# Altium schematic sheet Arduino_Pro_Micro_SCH.SchDoc
size A4; SheetNumber: 1; SheetTotal: 1
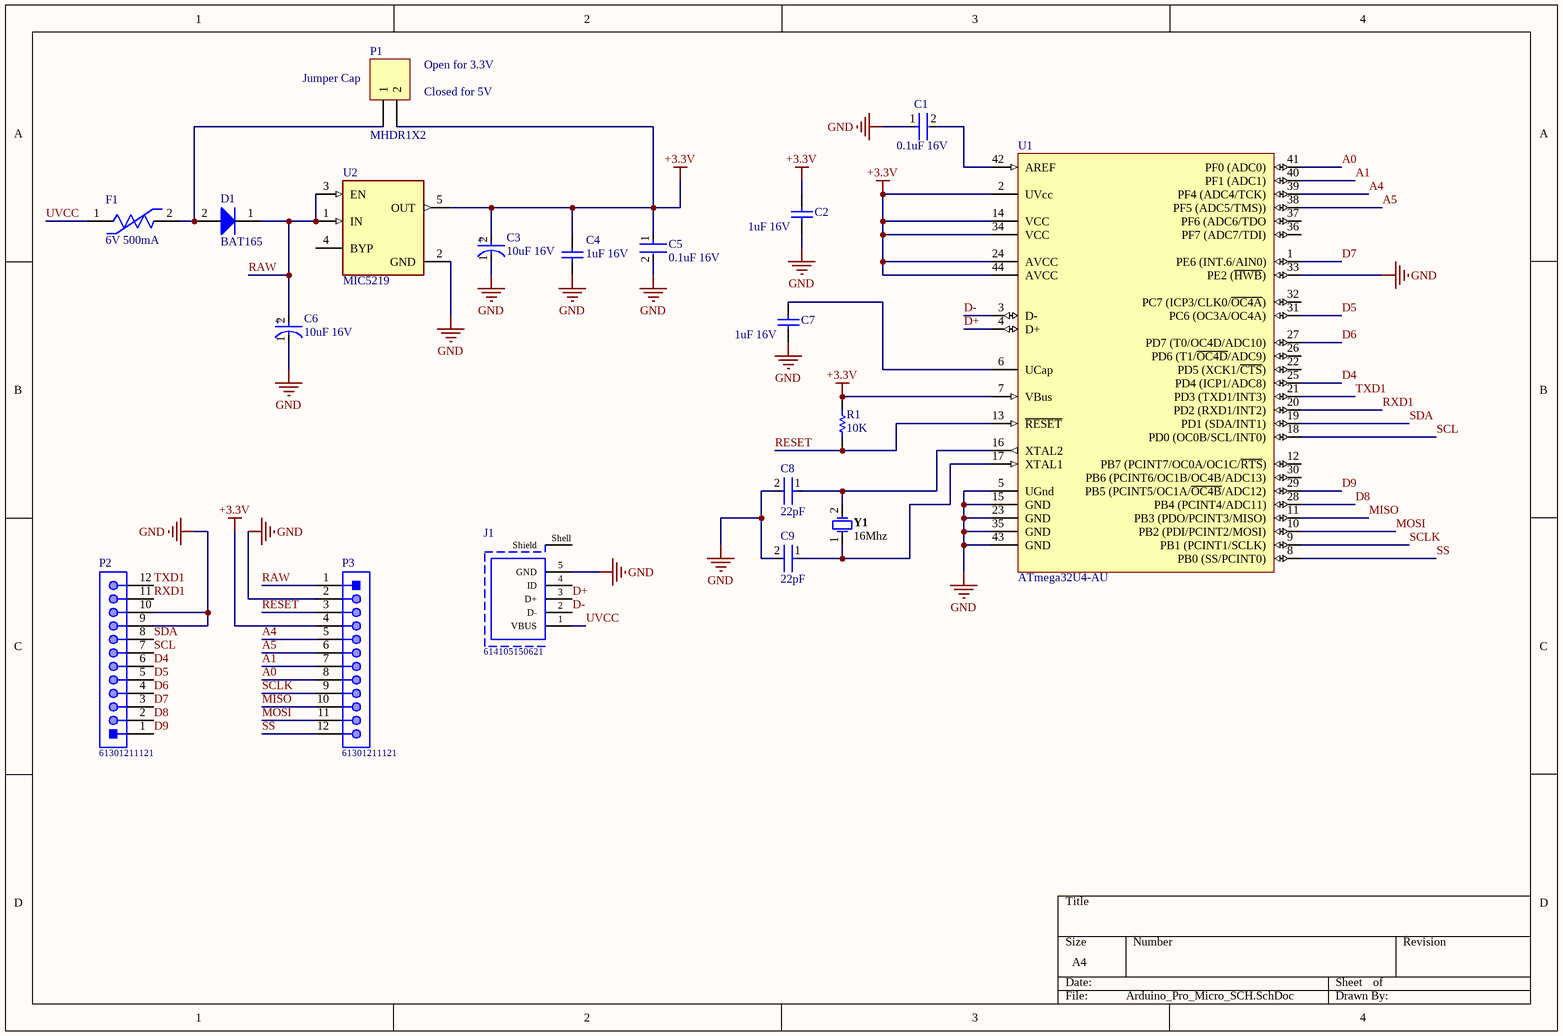
[diagram p0: Arduino_Pro_Micro_SCH.SchDoc]

## Parts
C1  0.1uF 16V  [FP-C0805C-DN-MFG]
C2  1uF 16V  [CAPC2013X145X50LL20T25]
C3  10uF 16V  [FP-T491C106K016AT-MFG]
C4  1uF 16V  [CAPC2013X145X50LL20T25]
C5  0.1uF 16V  [FP-C0805C-DN-MFG]
C6  10uF 16V  [FP-T491C106K016AT-MFG]
C7  1uF 16V  [CAPC2013X145X50LL20T25]
C8  22pF  [FP-C0805C-DN-MFG]
C9  22pF  [FP-C0805C-DN-MFG]
D1  BAT165  [INF-SOD323_V]
F1  6V 500mA  [FP-1206L050YR-MFG]
J1  614105150621  [614105150621]
P1  MHDR1X2  [MHDR1X2]
P2  61301211121  [61301211121]
P3  61301211121  [61301211121]
R1  10K  [RESC2013X60X35NL10T20]
U1  ATmega32U4-AU  [44ML_L]
U2  MIC5219  [FP-SOT23-5LD-PL-1-IPC_C]
Y1  16Mhz  [FOX-HC49SDLF_V]

## Nets
+3.3V: C2.2 C3.2(A) C4.2 C5.1 P1.2 P3.4 R1.2 U1.2(UVcc) U1.7(VBus) U1.14(VCC) U1.24(AVCC) U1.34(VCC) U1.44(AVCC) U2.5(OUT)
GND: C1.1 C2.1 C3.1(C) C4.1 C5.2 C6.1(C) C7.1 C8.2 C9.2 J1.5(GND) P2.9 P2.10 P3.2 U1.5(UGnd) U1.15(GND) U1.23(GND) U1.33(PE2_(~{HWB})) U1.35(GND) U1.43(GND) U2.2(GND)
A0: P3.8 U1.41(PF0_(ADC0))
A1: P3.7 U1.40(PF1_(ADC1))
A4: P3.5 U1.39(PF4_(ADC4/TCK))
A5: P3.6 U1.38(PF5_(ADC5/TMS)))
D4: P2.6 U1.25(PD4_(ICP1/ADC8))
D5: P2.5 U1.31(PC6_(OC3A/OC4A))
D6: P2.4 U1.27(PD7_(T0/OC4D/ADC10))
D7: P2.3 U1.1(PE6_(INT.6/AIN0))
D8: P2.2 U1.28(PB4_(PCINT4/ADC11))
D9: P2.1 U1.29(PB5_(PCINT5/OC1A/~{OC4B}/ADC12))
D+: J1.3(D+) U1.4(D+)
D-: J1.2(D-) U1.3(D-)
MISO: P3.10 U1.11(PB3_(PDO/PCINT3/MISO))
MOSI: P3.11 U1.10(PB2_(PDI/PCINT2/MOSI))
RAW: C6.2(A) D1.1(K) P3.1 U2.1(IN) U2.3(EN)
RESET: P3.3 R1.1 U1.13(~{RESET})
RXD1: P2.11 U1.20(PD2_(RXD1/INT2))
SCL: P2.7 U1.18(PD0_(OC0B/SCL/INT0))
SCLK: P3.9 U1.9(PB1_(PCINT1/SCLK))
SDA: P2.8 U1.19(PD1_(SDA/INT1))
SS: P3.12 U1.8(PB0_(SS/PCINT0))
TXD1: P2.12 U1.21(PD3_(TXD1/INT3))
UVCC: F1.1 J1.1(VBUS)
NetC1_2: C1.2 U1.42(AREF)
NetC7_2: C7.2 U1.6(UCap)
NetC8_1: C8.1 U1.16(XTAL2) Y1.2
NetC9_1: C9.1 U1.17(XTAL1) Y1.1
NetD1_2: D1.2(A) F1.2 P1.1

Not connected (* = marked no-connect by the designer): J1 4(ID) Shell(Shield); U1 12(PB7_(PCINT7/OC0A/OC1C/~{RTS})) 22(PD5_(XCK1/~{CTS})) 26(PD6_(T1/~{OC4D}/ADC9)) 30(PB6_(PCINT6/OC1B/OC4B/ADC13)) 32(PC7_(ICP3/CLK0/~{OC4A})) 36(PF7_(ADC7/TDI)) 37(PF6_(ADC6/TDO); U2 4(BYP)

## Notes on the sheet
- (near P1) Jumper Cap
- (near P1) Open for 3.3V
- (near P1) Closed for 5V
- (in symbol CMP-2000-07197-3) +

## Library data of the parts
C1 C5 = CMP-2007-00274-2: CAP CER 0.1UF 16V X7R 0805; Manufacturer Part Number: C0805C104K4RACTU; Manufacturer: KEMET; Material: Ceramic; Tolerance: 0.1; Capacitance: 0.10 μF; Value: 0.10 μF; Temperature Coefficient: 30ppm/°C; Device Class L3: Ceramic Capacitors; RoHS: TRUE; Octopart: https://octopart.com/c0805c104k4ractu-kemet-92155; ComponentLink2Description: Datasheet; ComponentLink2URL: https://content.kemet.com/datasheets/KEM_C1003_C0G_SMD.pdf; Temperature Range High: +125°C; Category: Cap; Lead Free: Yes; Digikey Description: CAP CER 0.1UF 16V X7R 0805; Automotive: No; Temperature Range Low: -55°C; Voltage Rating: 16 V; Package: C0805C-DN; Ipc Land Pattern Name: CAPC200125X78; Height: 0.88mm; Device Class L1: Passive Components; Temperature: -55°C to +125°C; Mouser Description: Multilayer Ceramic Capacitors MLCC - SMD/SMT 16volts 0.1uF X7R 10%; Device Class L2: Capacitors; Temperature Characteristic: X7R
C2 C4 C7 = CMP-1036-04746-2: Manufacturer: Kemet; Part Number: C0805C105K4PACTU
C3 C6 = CMP-2000-07197-3: CAP TANT 10UF 10% 16V 2312; Dielectric Material: Tantalum; Polarity: Polar; Dissipation Factor: 6%; Leakage Current: 1.6uA; Ripple Current: 247mA; Life (Hours): 2000Hour; ESR (Equivalent Series Resistance): 1.8R; Height: 2.5mm; Length: 6mm; Min Operating Temperature: -55°C; Case/Package: Molded; Voltage: 16V; Height - Seated (Max): 0.11inch; Package Quantity: 1; RoHS Compliant: Yes; Termination: SMD/SMT; REACH SVHC: No SVHC; Case Code (Imperial): 2312; Tolerance: 10%; Capacitance: 10uF; Voltage Rating (DC): 16V; Mount: Surface Mount; Radiation Hardening: No; Case Code (Metric): 6032; Packaging: Tape and Reel; Depth: 3.2mm; Width: 3.2mm; Max Operating Temperature: 125°C; Features: General Purpose; Voltage Rating: 16V; Lead Free: Lead Free
C8 C9 = CMP-2007-00048-2: Capacitor; Ceramic; Cap; 22.0pF; Tol 5%; SMT; Vol-Rtg 50V; C0G; Tape and Reel; Manufacturer: KEMET; Manufacturer Part Number: C0805C220J5GACTU; Temperature Coefficient: 30ppm/°C; Tolerance: 0.05; Device Class L1: Passive Components; Mouser Description: Multilayer Ceramic Capacitors MLCC - SMD/SMT 50volts 22pF C0G 5%; Temperature Range Low: -55°C; Automotive: No; Voltage Rating: 50 V; Material: Ceramic; Category: Cap; Height: 0.88mm; Temperature Range High: +125°C; Capacitance: 22 pF; Digikey Description: Capacitor; Ceramic; Cap; 22.0pF; Tol 5%; SMT; Vol-Rtg 50V; C0G; Tape and Reel; Octopart: https://octopart.com/c0805c220j5gactu-kemet-145470; ComponentLink2Description: Datasheet; Device Class L2: Capacitors; Ipc Land Pattern Name: CAPC200125X78; Value: 22 pF; RoHS: TRUE; ComponentLink2URL: https://content.kemet.com/datasheets/KEM_C1003_C0G_SMD.pdf; Temperature: -55°C to +125°C; Device Class L3: Ceramic Capacitors; Lead Free: Yes; Temperature Characteristic: C0G; Package: C0805C-DN
D1 = CMP-1183-00004-1: Medium Power AF Schottky Diode, SOD323, Reel, Green; Manufacturer: Infineon; IF (max): 750Â mA; VF (max): 700Â mV; VR (max): 40Â V; CT (max): 12Â pF; Configuration: Single; Green: TRUE; ComponentLink3URL: http://www.infineon.com/dgdl/SOD323-Package_Overview.pdf?folderId=db3a30431936bc4b011952aab84f3bbe&fileId=db3a30431936bc4b011952beed653be3; PackageReference: SOD323; ComponentLink1URL: http://www.infineon.com/; PartNumber: BAT165; Mounting Technology: Surface Mount; PackageDescription: 2-Pin Small Outline Diode Package, 1.25 x 1.7 mm Body; ComponentLink1Description: Manufacturer URL; ComponentLink3Description: Package Specification; ComponentLink2URL: http://www.infineon.com/dgdl/bat165series.pdf?folderId=db3a304313d846880113def5812204a1&fileId=db3a304313d846880113df01f69804d6; Packing: Reel; ComponentLink2Description: Datasheet
F1 = CMP-08606-000073-1: PTC RESET FUSE 6V 500MA 1206; Trip Current: 1A; Current Rating: 100A; Resistance: 700mR; Approvals: cULus; Max Power Dissipation: 600mW; Time to Trip: 0.1s; Hold Current: 500mA; Min Operating Temperature: -40°C; Voltage Rating (DC): 6V; Working Voltage: 6V; Package Quantity: 4000; Termination: SMD/SMT; Lead Free: Lead Free; REACH SVHC: No SVHC; Series: 1206L; Max Voltage Rating (DC): 6V; Height: 0.75mm; Terminal Material: Copper; Packaging: Tape and Reel; Case Code (Imperial): 1206; Length: 3.4mm; RoHS Compliant: Yes; Operating Supply Voltage: 6V; Case Code (Metric): 3216; Width: 1.8mm; Max Current Rating: 100A; Case/Package: 1206; Power Dissipation: 600mW; Max Operating Temperature: 85°C; Voltage Rating: 6V
J1 = CMP-1502-03251-1: Micro USB 2.0 Type AB Receptacle WR-COM, Vertical, THT; Manufacturer: Wurth Elektronik; Rated Current: 1.8A; Working Voltage: 30VAC; Contact Resistance: 30mOhm; Manufacturer URL: http://www.we-online.de; Orientation: Vertical; Packaging: TapeandReel; Package Reference: 614105150621; Part Number: 614105150621; Operating Temperature: -40to85degC; Connector Type: MicroUSB2.0TypeAB; Gender: Receptacle; Mounting Technology: THT; Datasheet URL: https://katalog.we-online.de/em/datasheet/614105150621.pdf; Publisher: WurthElektronik
P1 = MHDR1X2: Header, 2-Pin; LatestRevisionDate: 17-Jul-2002; LatestRevisionNote: Re-released for DXP Platform.; Publisher: Altium Limited
P2 P3 = CMP-1502-01086-1: THT Vertical Pin Header WR-PHD, Pitch 2.54 mm, Single Row, 12 pins; Manufacturer: Wurth Elektronik; Pin Number: 12; Gender: Male; Working Voltage: 250VAC; Rated Current: 3A; Withstanding Voltage: 500VAC; Pitch: 2.54mm; Contact Resistance: 20mOhm; Orientation: Vertical; Package Reference: 61301211121; Packaging: Bag; Operating Temperature: -40to105degC; Mounting Technology: THT; Part Number: 61301211121; Manufacturer URL: http://www.we-online.de; Row Number: Single; Publisher: WurthElektronik; Datasheet URL: https://katalog.we-online.de/em/datasheet/6130xx11121.pdf
R1 = CMP-1659-00013-4: Chip Resistor, 10 KOhm, +/- 1%, 0.125 W, -55 to 155 degC, 0805 (2012 Metric), RoHS, Tape and Reel; Manufacturer: Yageo; Voltage Rating: 150 V; Mount: Surface Mount; ComponentLink1Description: Manufacturer URL; ComponentLink2URL: http://www.yageo.com/documents/recent/PYu-RC_Group_51_RoHS_L_04.pdf; Pins: 2; Length: 2 mm; Min Operating Temperature: -55 degC; Height: 0.5 mm; Mounting Technology: Surface Mount; RoHSCompliant: true; REACH SVHC: No SVHC; ComponentLink1URL: http://www.yageo.com/; Max Operating Temperature: 155 degC; PackageReference: 0805; DatasheetVersion: Rev. 4, 02/2016; Package Quantity: 5000; Packaging: Tape and Reel; ComponentLink2Description: Datasheet; PackageDescription: 2-Pin Surface Mounted Device, Body 2 x 1.25 mm
U1 = CMP-0095-00285-2: 8-bit AVR Microcontroller, 2.7-5.5V, 16MHz, 32KB Flash, 1KB EEPROM, 2.5KB SRAM, USB Controller, 44-pin TQFP, Industrial Grade (-40°C to 85°C), Ext Osc; RevisionNote: DatasheetVersion updated. URLs added.; ComponentLink1Description: Manufacturer URL; PackageDescription: 44-Pin Plastic Thin Quad Flat Pack, 10 x 10 x 1.0 mm Body, 0.8 mm Pitch (TQFP); DatasheetVersion: revF, Nov-2010; ComponentLink2URL: http://www.atmel.com/dyn/resources/prod_documents/doc7766.pdf; ComponentLink1URL: http://www.atmel.com/; PackageReference: 44ML; ComponentLink2Description: ATmega16U4/32U4 Datasheet; PackageVersion: rev.G, Jul-2007; ComponentLink3URL: http://www.atmel.com/dyn/resources/prod_documents/7766S.pdf; ComponentLink3Description: ATmega16U4 ATmega32U4 Summary
U2 = CMP-06324-000027-1: IC REG LINEAR 3.3V 500MA SOT23-5; Dropout Voltage: 350mV; Output Type: Fixed; Number of Regulators: 1; Max Input Voltage: 12V; Min Input Voltage: 2.5V; Min Operating Temperature: -40°C; Nominal Output Voltage: 3.3V; Output Voltage: 3.3V; Packaging: Cut Tape; Mount: Surface Mount; Number of Pins: 5; Case/Package: SOT-23-5; Lead Free: Lead Free; Max Operating Temperature: 125°C; REACH SVHC: No SVHC; Output Current: 500mA
Y1 = CMP-2100-03639-1: Resistance Weld Crystal, 8 MHz, +/- 30 ppm, -20 to 70 degC, 2-Pin SMD, RoHS, Tape and Reel; Manufacturer: FOX Electronics; Series Resistance: 80Ohm; Frequency: 8MHz; Load Capacitance: 20pF; Tolerance: 50ppm; Frequency Tolerance: 30ppm; Datasheet URL: http://www.foxonline.com/pdfs/hc49sdlf.pdf; Package Reference: HC49SDLF; Height: 4.5mm; Mount: SurfaceMount; Packaging: TapeandReel; Length: 11.7mm; Termination: SMD/SMT; Number of Pins: 2; Depth: 5mm; Min Operating Temperature: -20degC; Package Quantity: 1000; RoHSCompliant: True; Lead Free: LeadFree; Width: 5mm; Case/Package: SMD/SMT; Manufacturer URL: http://www.foxonline.com/; Max Operating Temperature: 70degC; REACH SVHC: NoSVHC; Datasheet Version: 42064.0; Package Description: 2-Pin Surface Mount Device, Body 5 x 11.7 mm; Frequency Stability: 50ppm; ESR (Equivalent Series Resistance): 80Ohm; Radiation Hardening: No